# EAGLE design reflow_controller (EAGLE 7.2.0)
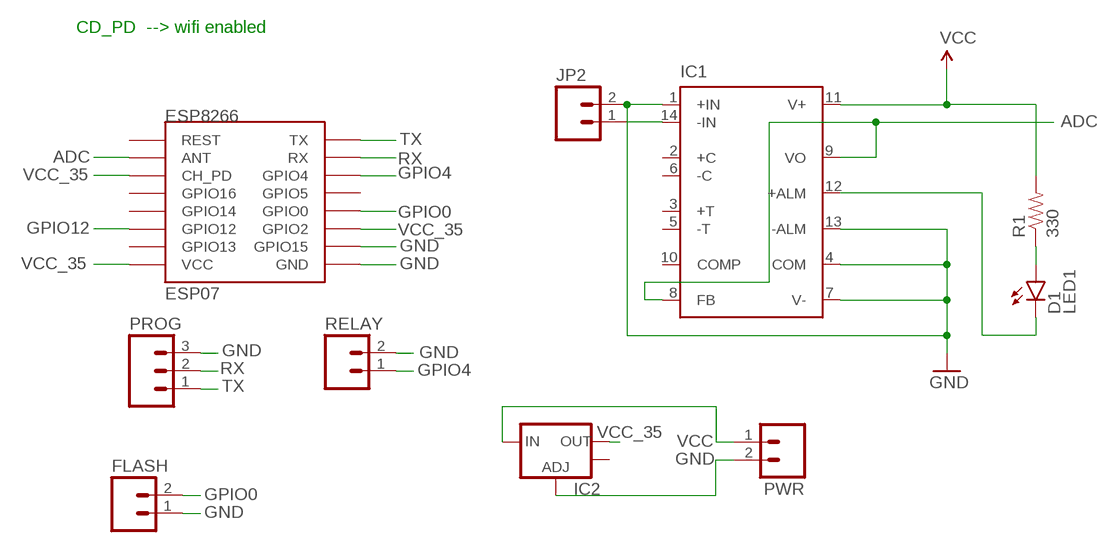
[diagram p0: schematic, sheet 1]

## Parts
D1  LED1  LED5MM  [LED5MM]
ESP8266  ESP07  [ESP07]
FLASH  M02LOCK  [1X02_LOCK]
IC1  AD595  [DIL14]
IC2  V_REG_LM1117SOT223  [SOT223]
JP2  M025MM  [SCREWTERMINAL-5MM-2]
PROG  M03PTH  [1X03]
PWR  M02LOCK  [1X02_LOCK]
R1  330  RESISTORKIT  [AXIAL-0.3-KIT]
RELAY  M02LOCK  [1X02_LOCK]

## Nets
ADC: ESP8266.ANT IC1.8(FB) IC1.9(VO)
GND: ESP8266.GND ESP8266.GPIO15 FLASH.1 IC1.1(+IN) IC1.4(COM) IC1.7(V-) IC1.13(-ALM) IC2.1(ADJ) JP2.2 PROG.3 PWR.2 RELAY.2
GPIO0: ESP8266.GPIO0 FLASH.2
GPIO4: ESP8266.GPIO4 RELAY.1
GPIO12: ESP8266.GPIO12
N$1: D1.A R1.P$1
N$3: IC1.14(-IN) JP2.1
N$5: D1.K(C) IC1.12(+ALM)
RX: ESP8266.RX PROG.2
TX: ESP8266.TX PROG.1
VCC: IC1.11(V+) IC2.3(IN) PWR.1 R1.P$2
VCC_35: ESP8266.CH_PD ESP8266.GPIO2 ESP8266.VCC IC2.2(OUT)
Unconnected: ESP8266.GPIO5 ESP8266.GPIO13 ESP8266.GPIO14 ESP8266.GPIO16 ESP8266.REST IC1.2(+C) IC1.3(+T) IC1.5(-T) IC1.6(-C) IC1.10(COMP) IC2.4(OUT)

## Notes on the sheet
- CD_PD  --> wifi enabled

## Library data of the parts
D1 = SparkFun-LED:LED: LEDs Standard schematic elements and footprints for 5mm, 3mm, 1206, and 0603 sized LEDs. 5mm - Spark Fun Electronics SKU : COM-00529 (and others)
ESP8266 = AndyLibrary:ESP07: ESP8266 Wifi module 07 & 08
FLASH PWR RELAY = SparkFun-Connectors:M02: Standard 2-pin 0.1" header. Use with - straight break away headers ( PRT-00116) - right angle break away headers (PRT-00553) - swiss pins (PRT-00743) - machine pins (PRT-00117) - female headers (PRT-00115) Molex polarized connector foot print use with: PRT-08233 with associated crimp pins and housings. 2.54_SCREWTERM for use with PRT-10571. 3.5mm Screw Terminal footprints for PRT-08084 5mm Screw Terminal footprints for use with PRT-08432
IC1 = analog-devices:AD595: ANALOG DEVICES; MPN: AD595AQ; OC_FARNELL: 409194; OC_NEWARK: 06WX1596
IC2 = SparkFun-PowerIC:V_REG_LM1117: Voltage Regulator LM1117 Standard adjustable voltage regulator but in SMD form. Spark Fun Electronics SKU : COM-00595; PROD_ID: VREG-08170
JP2 = SparkFun-Connectors:M02: Standard 2-pin 0.1" header. Use with - straight break away headers ( PRT-00116) - right angle break away headers (PRT-00553) - swiss pins (PRT-00743) - machine pins (PRT-00117) - female headers (PRT-00115) Molex polarized connector foot print use with: PRT-08233 with associated crimp pins and housings. 2.54_SCREWTERM for use with PRT-10571. 3.5mm Screw Terminal footprints for PRT-08084 5mm Screw Terminal footprints for use with PRT-08432; STOREFRONT_ID: PRT-08432
PROG = SparkFun-Connectors:M03: Header 3 Standard 3-pin 0.1" header. Use with straight break away headers (SKU : PRT-00116), right angle break away headers (PRT-00553), swiss pins (PRT-00743), machine pins (PRT-00117), and female headers (PRT-00115). Molex polarized connector foot print use with SKU : PRT-08232 with associated crimp pins and housings.
R1 = SparkFun-Resistors:RESISTOR: Resistor Basic schematic elements and footprints for 0603, 1206, and PTH resistors.

## Net classes
0 default: clearance 0.205 mm

## Board
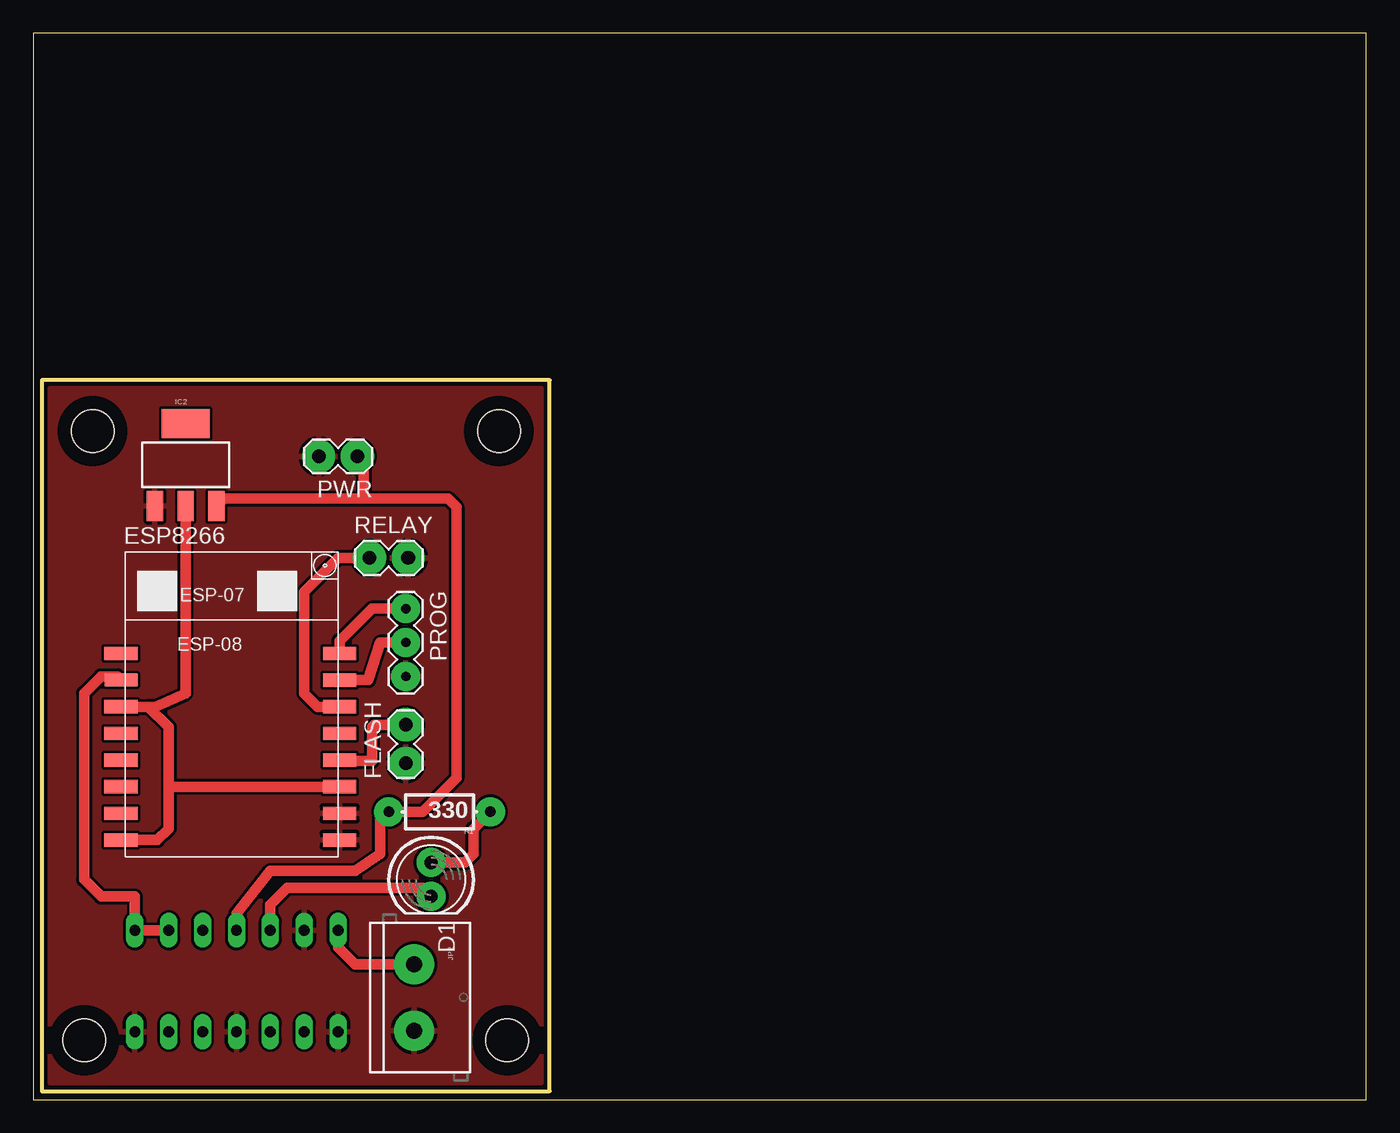
[diagram p1: board, top side]
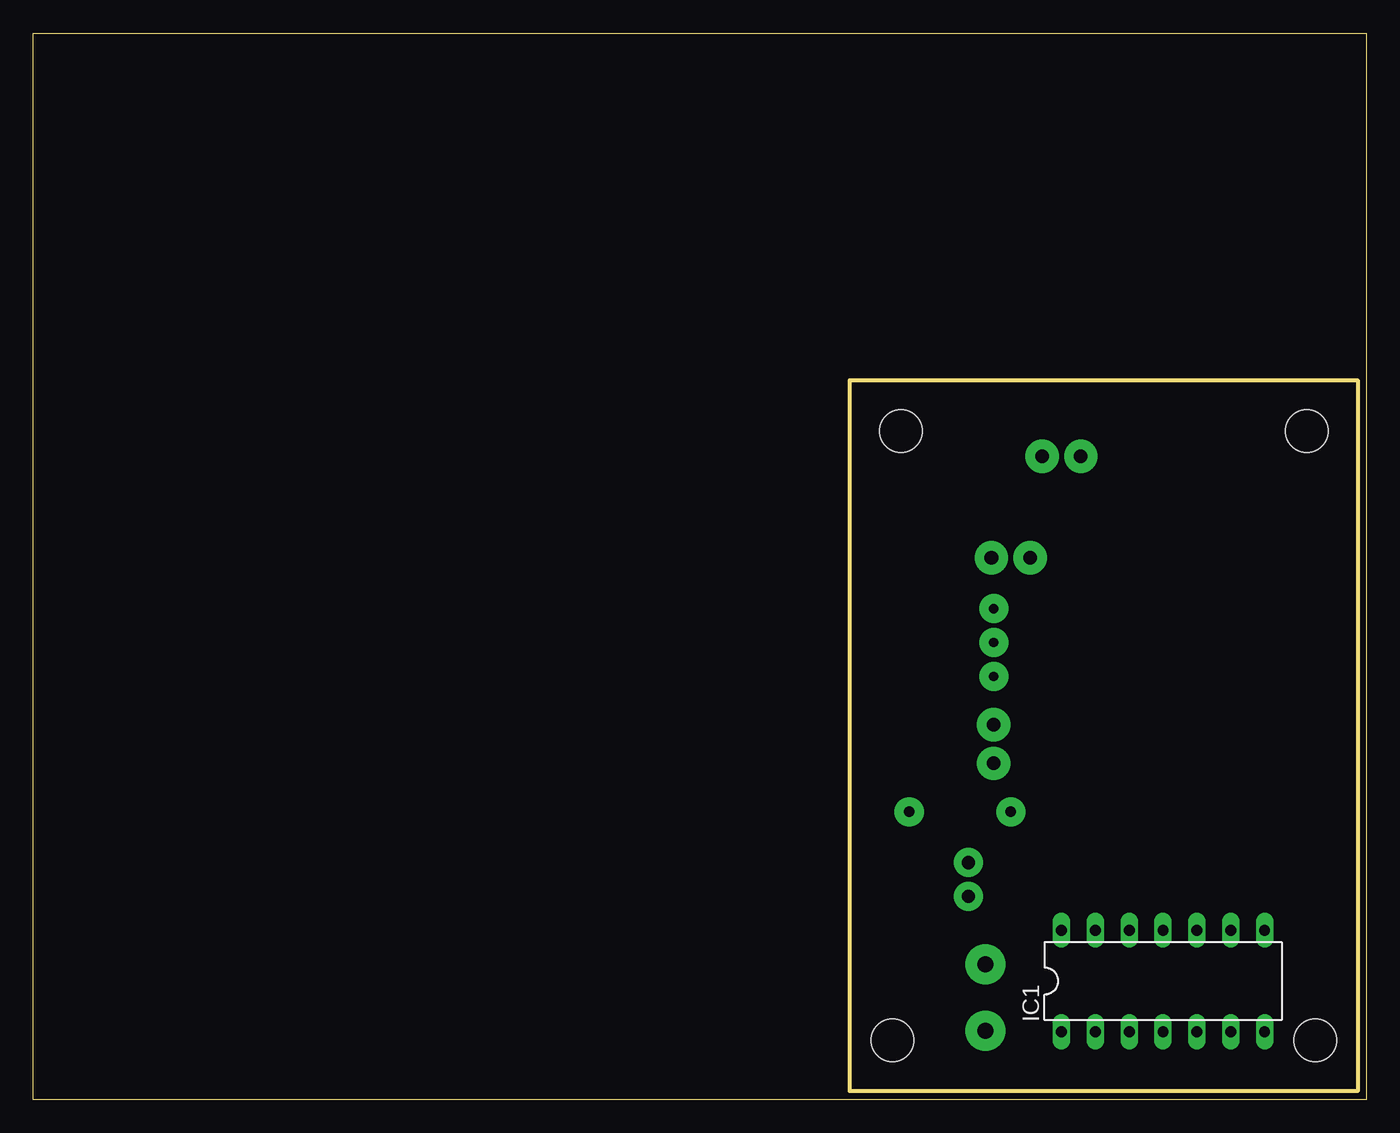
[diagram p2: board, bottom side, seen from below]

Size 100 x 80 mm. Coordinates in mm from the lower left corner, seen from the top.
Outline: 0,0 100,0 100,80 0,80 0,0
Copper layers (1*16): Top 0.035mm / dielectric 1.5mm / Bottom 0.035mm
Design rules "default *": minimum track width 0.2mm, minimum drill 0.8mm, track to track 8mil, track to pad 8mil, pad to pad 8mil, via to via 8mil, smd to smd 8mil, copper to edge 40mil, drill to drill 8mil, minimum pad ring 10mil, minimum via ring 8mil, stop-mask expansion 4mil, vias tented up to drill 0mil, thermal gap 10mil
Holes 3.2 mm at 4.45,50.16 35.56,4.45 3.81,4.45 34.92,50.16
Milling: 4 lines

### Footprints (pad centres in the part's own frame; a part is rotated, then mirrored left to right if it is on the bottom)
LED5MM = drill 1 pad 2.184: A -1.27,0; K 1.27,0
ESP07 = smd 2.5 x 1: ANT -11.2,4.8; CH_PD -11.2,2.8; GND 5.2,-7.2; GPIO0 5.2,-1.2; GPIO2 5.2,-3.2; GPIO4 5.2,2.8; GPIO5 5.2,0.8; GPIO12 -11.2,-3.2; GPIO13 -11.2,-5.2; GPIO14 -11.2,-1.2; GPIO15 5.2,-5.2; GPIO16 -11.2,0.8; REST -11.2,6.8; RX 5.2,4.8; TX 5.2,6.8; VCC -11.2,-7.2
1X02_LOCK = drill 1.016 pad 2.5: 1 -0.178,0; 2 2.718,0
DIL14 = drill 0.813 long: 1 -7.62,-3.81; 2 -5.08,-3.81; 3 -2.54,-3.81; 4 0,-3.81; 5 2.54,-3.81; 6 5.08,-3.81; 7 7.62,-3.81; 8 7.62,3.81; 9 5.08,3.81; 10 2.54,3.81; 11 0,3.81; 12 -2.54,3.81; 13 -5.08,3.81; 14 -7.62,3.81
SOT223 = smd 1.219 x 2.235: 1 -2.311,-3.099; 2 0,-3.099; 3 2.311,-3.099 | smd 3.6 x 2.2: 4 0,3.099
SCREWTERMINAL-5MM-2 = drill 1.2 pad 3: 1 0,0; 2 5,0
1X03 = drill 0.7 pad 2.184: 1 0,0; 2 2.54,0; 3 5.08,0
AXIAL-0.3-KIT = drill 0.8 pad 2.184: P$1 -3.81,0; P$2 3.81,0

### Placement (x,y rotation side)
D1  29.84,16.51 270 top
ESP8266  17.78,26.67 0 top
FLASH  27.94,25.4 90 top
IC1  15.24,8.89 0 bottom
IC2  11.43,47.62 0 top
JP2  28.57,10.16 270 top
PROG  27.94,36.83 270 top
PWR  24.13,48.26 180 top
R1  30.48,21.59 180 top
RELAY  25.4,40.64 0 top

### Tracks (layer width: path | path; a pad name or v marks a point on that pad's centre or on a via)
ADC
  Top 0.8: ESP8266.ANT 6.3,31.75 5.08,31.75 3.81,30.48 3.81,16.51 5.08,15.24 7.62,15.24 IC1.8 IC1.9
GND
  pour Top: 1.27,53.34 1.27,1.27 38.1,1.27 38.1,53.34
GPIO0
  Top 0.8: ESP8266.GPIO0 23.05,25.4 25.4,25.4 25.4,27.94 25.58,28.12 FLASH.2
GPIO4
  Top 0.8: RELAY.1 22.86,40.64 20.32,38.1 20.32,30.48 21.33,29.47 ESP8266.GPIO4
N$1
  Top 0.8: D1.A 32.38,17.78 33.02,18.41 33.02,20.32 R1.P$1
N$3
  Top 0.8: IC1.14 22.86,11.43 24.13,10.16 JP2.1
N$5
  Top 0.8: D1.K 29.21,15.88 19.05,15.88 17.78,14.61 IC1.12
RX
  Top 0.8: PROG.2 26.04,34.29 25.12,31.47 ESP8266.RX
TX
  Top 0.8: PROG.1 25.4,36.83 22.98,34.41 ESP8266.TX
VCC
  Top 0.8: IC1.11 15.24,13.97 17.78,17.14 24.13,17.14 26.04,18.41 26.04,20.95 R1.P$2 29.21,21.59 31.75,24.13 31.75,44.45 31.11,45.09 24.77,45.09 | IC2.3 14.3,45.09 24.77,45.09 | PWR.1 24.77,47.8 24.77,45.09
VCC_35
  Top 0.8: IC2.2 11.43,30.48 9.15,29.47 ESP8266.CH_PD 8.63,29.47 10.16,27.94 10.16,23.47 | 10.16,23.47 10.16,20.32 9.31,19.47 ESP8266.VCC | ESP8266.GPIO2 10.16,23.47